# Altium schematic sheet PMP30528_RevB.SchDoc (part 2 of 2)
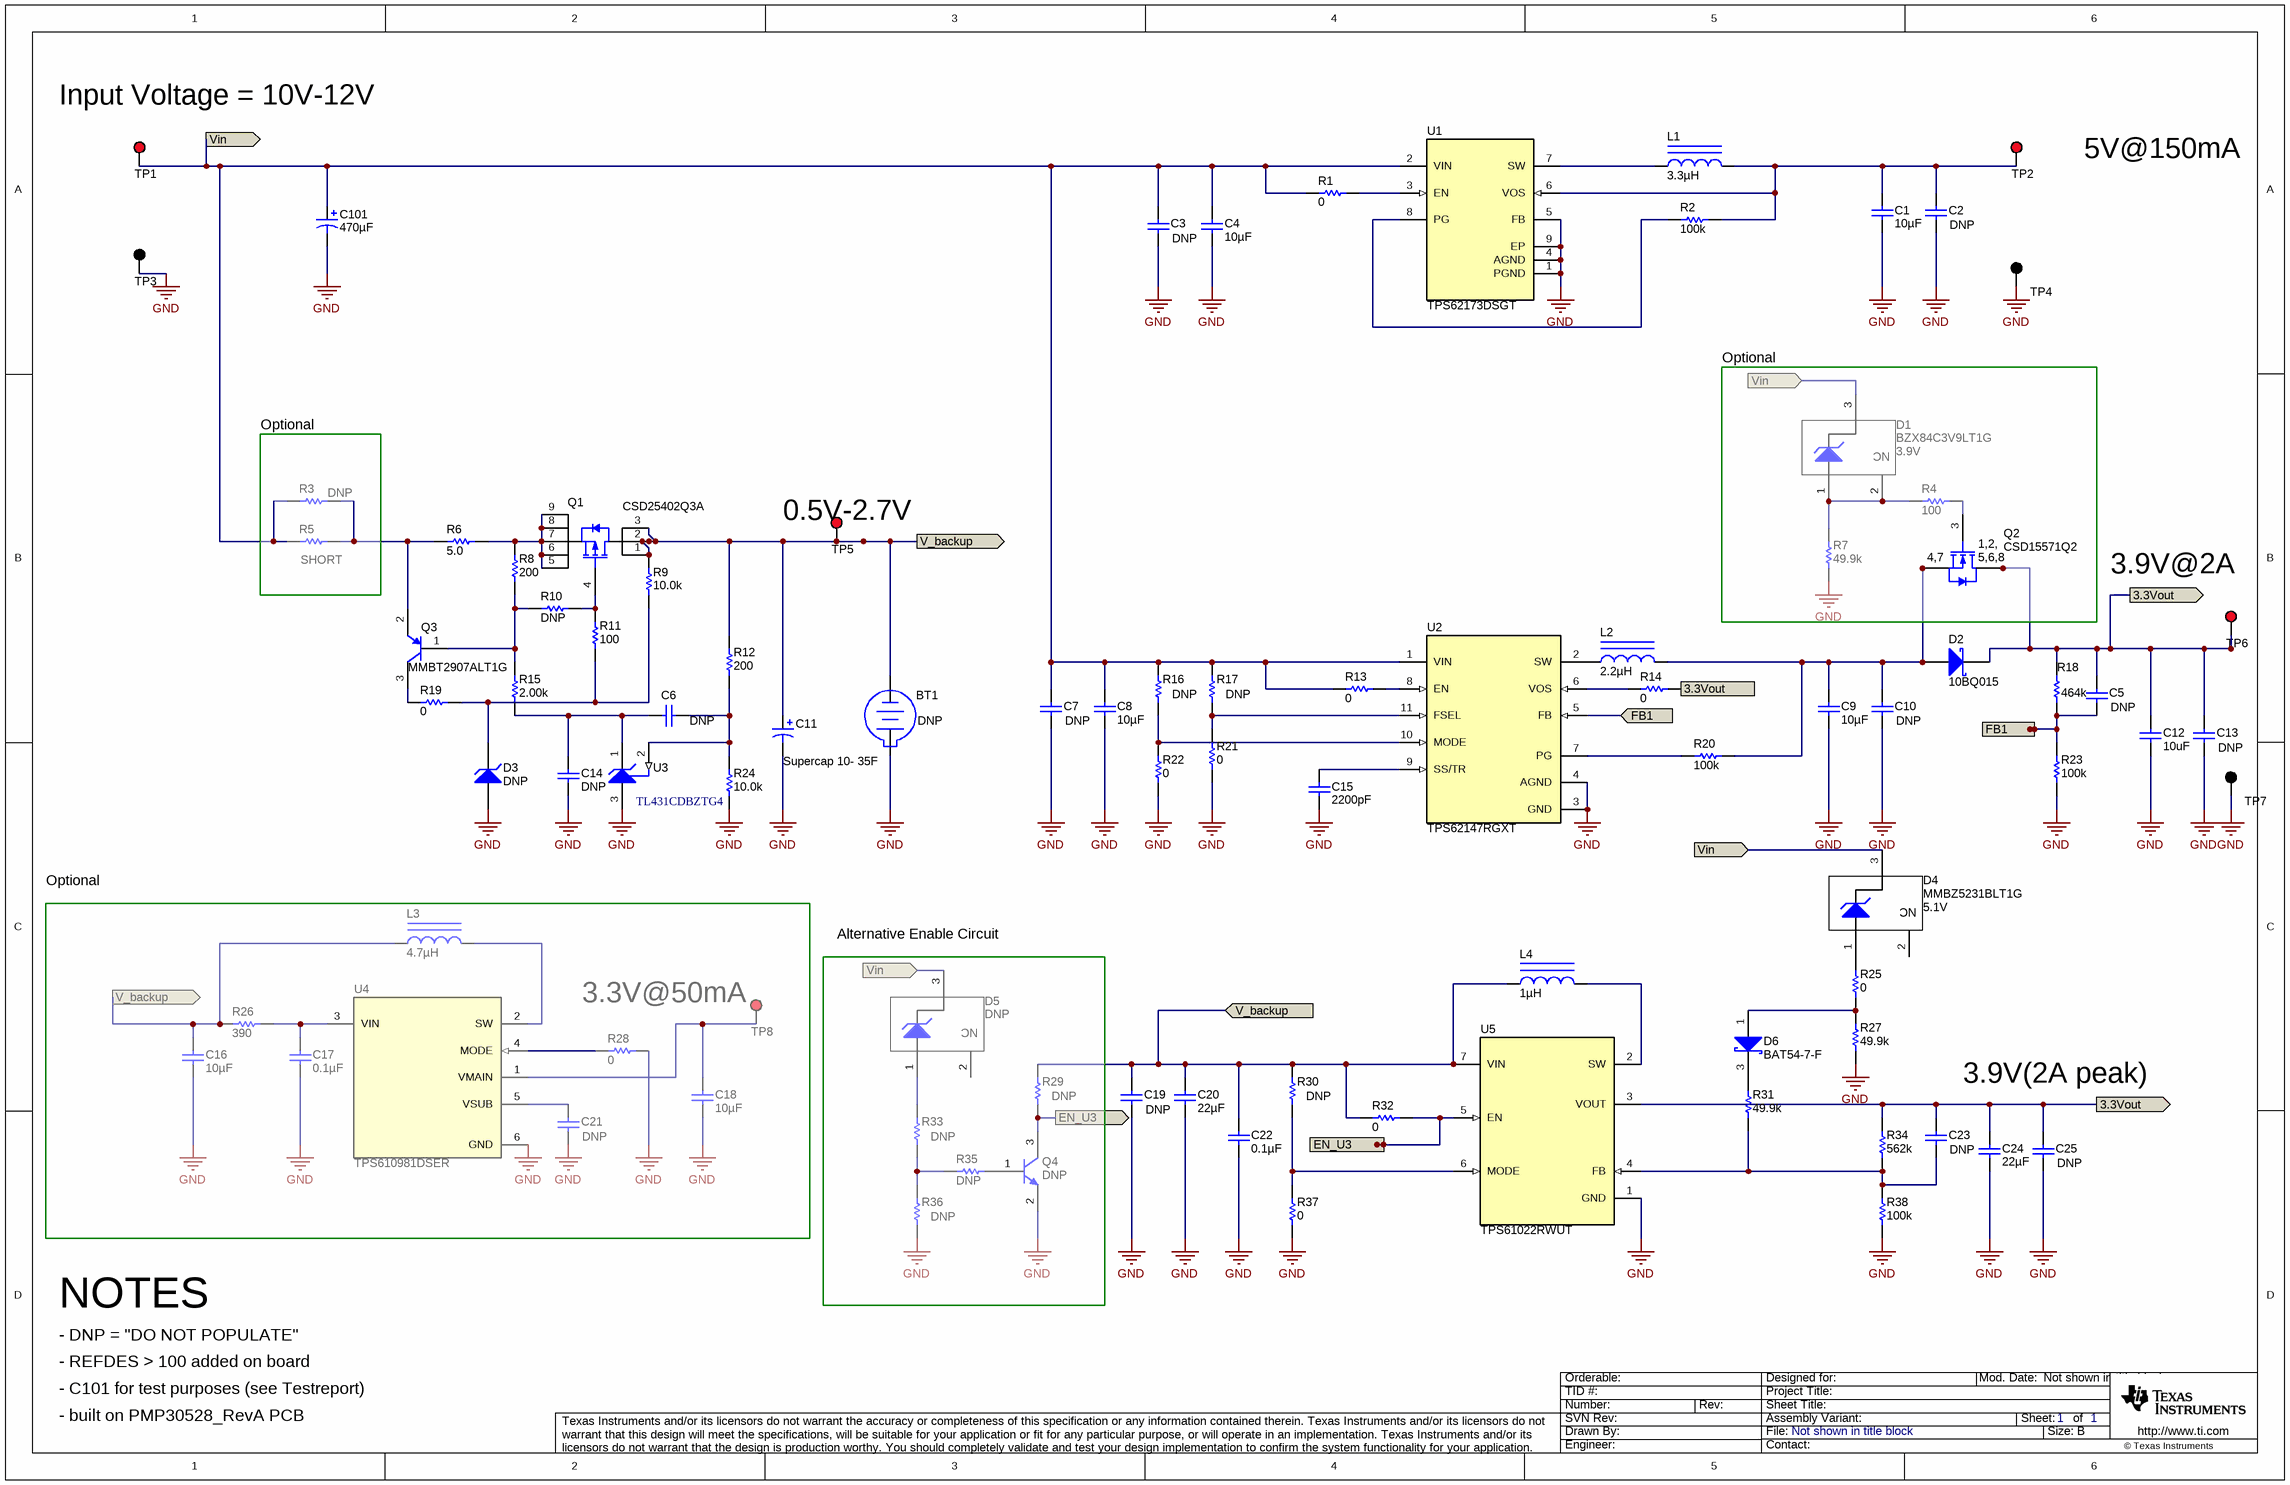
[diagram p1: PMP30528_RevB.SchDoc]

## Library data of the parts
BT1 = CMP-0081781-1: HOLDER CR2032 GOLD LEADS SMD; Manufacturer: Memory Protection Devices; CompType: Battery Holder; ComponentLink1URL: http://www.memoryprotectiondevices.com/datasheets/BU2032SM-BT-GTR-datasheet.pdf; Key: BU2032SM-BT-GTR; Supplier 1: Digi-Key; PackageReference: 31.86x16mm; RoHS: Y; Supplier Part Number 1: BU2032SM-BT-GCT-ND; MountType: SMT; ComponentLink1Description: Datasheet Link
C1 = GRM21BR71A106KE51K: CAP, CERM, 10 µF, 10 V,+/- 10%, X7R, 0805; Manufacturer: MuRata; Polarized: N; CompType: Capacitor; Value: 10uF; U/M: EA; Cap_F: 0.00001; Tolerance_%: 10; Value2: 10V; TaMin_C: -55; TaMax_C: 125; Cap_Case: 0805; SizeArea_mm2: 2.5; SizeAreaWB_mm2: 6.75; SizeX_mm: 2; SizeY_mm: 1.25; SizeZ_mm: 1.45; AEC Category: Q200; Green_Lifecycle: Active; Green_REACh: Passed; SymbolVersion: 2008-07-09; PartNumber: GRM21BR71A106KE51K; PackageReference: 0805; RoHS: Y; VDC_V: 10; MountType: SMT; Technology: Ceramic; TempCo: X7R; Published: 2008-06-19; Publisher: Texas Instruments; LatestRevisionDate: 2017-06-22; ComponentLink1Description: Datasheet link; ComponentLink1URL: http://www.murata.com/~/media/webrenewal/support/library/catalog/products/capacitor/mlcc/c02e.ashx; Supplier 1: Digi-Key; Supplier Part Number 1: 490-6477-1-ND; Supplier 2: Mouser; Supplier Part Number 2: 81-GRM21BR71A106KE1K; AEC Qualified: ?; Green_EU RoHS: Passed; Green_EU RoHS-2: Incomplete
C2 C3 C6 C7 C10 C14 C19 C21 C25 = Capacitor: CAP, CERM, xxxF, xxV, [TempCo], xx%, [PackageReference]; Polarized: N; U/M: EA; CompType: Capacitor; SymbolVersion: 2008-07-09; PackageReference: Used in PnP output and some BOM reports; Manufacturer: Used in BOM report; PartNumber: Used in BOM report; RoHS: Used in BOM report.  Use Y or N.; MountType: SMT or TH (used in PnP report); ComponentLink1Description: Datasheet Link; ComponentLink1URL: Paste URL for datasheet here; Publisher: Texas Instruments; LatestRevisionDate: 2017-05-31; LatestRevisionNote: Added Alternate PartNumber and Alternate Manufacturer parameters to appropriate components.; Alternate Manufacturer: -; Alternate PartNumber: -
C4 = GRM21BZ71E106KE15L: CAP, CERM, 10 µF, 25 V,+/- 10%, X7R, 0805; Manufacturer: MuRata; Polarized: N; CompType: Capacitor; Value: 10uF; U/M: EA; Cap_F: 0.00001; Tolerance_%: 10; VDC_V: 25; Value2: 25V; TaMin_C: -55; TaMax_C: 125; Cap_Case: 0805; SizeArea_mm2: 2.5; SizeAreaWB_mm2: 6.75; SizeX_mm: 2; SizeY_mm: 1.25; SizeZ_mm: 1.45; AEC Category: Q200; SymbolVersion: 2008-07-09; PartNumber: GRM21BZ71E106KE15L; PackageReference: 0805; RoHS: Y; MountType: SMT; Technology: Ceramic; TempCo: X7R; Published: 2008-06-19; Publisher: Texas Instruments; LatestRevisionDate: 2017-06-22; ComponentLink1Description: Datasheet link; ComponentLink1URL: http://search.murata.co.jp/Ceramy/image/img/A01X/G101/ENG/GRM21BZ71E106KE15-01.pdf; Supplier 1: Mouser; Supplier Part Number 1: 81-GRM21BZ71E106KE5L; AEC Qualified: N; AEC Grade: N/A
C5 C23 = Capacitor: CAP, CERM, xxxF, xxV, [TempCo], xx%, [PackageReference]; Manufacturer: Used in BOM report; Polarized: N; U/M: EA; CompType: Capacitor; SymbolVersion: 2008-07-09; Value: DNP; PackageReference: Used in PnP output and some BOM reports; PartNumber: DNP; RoHS: Used in BOM report.  Use Y or N.; MountType: SMT or TH (used in PnP report); ComponentLink1Description: Datasheet Link; ComponentLink1URL: Paste URL for datasheet here; Publisher: Texas Instruments; LatestRevisionDate: 2017-05-31; LatestRevisionNote: Added Alternate PartNumber and Alternate Manufacturer parameters to appropriate components.; Alternate Manufacturer: -; Alternate PartNumber: -
C8 = GRM21BZ71E106KE15L: CAP, CERM, 10 µF, 25 V,+/- 10%, X7R, 0805; Manufacturer: MuRata; Polarized: N; CompType: Capacitor; Value: 10uF; U/M: EA; Cap_F: 0.00001; Tolerance_%: 10; VDC_V: 25; Value2: 25V; TaMin_C: -55; TaMax_C: 125; SizeArea_mm2: 2.5; SizeAreaWB_mm2: 6.75; SizeX_mm: 2; SizeY_mm: 1.25; SizeZ_mm: 1.45; AEC Category: Q200; SymbolVersion: 2008-07-09; PartNumber: GRM21BZ71E106KE15L; PackageReference: 0805; RoHS: Y; MountType: SMT; Technology: Ceramic; TempCo: X7R; Cap_Case: 0805; Published: 2008-06-19; Publisher: Texas Instruments; LatestRevisionDate: 2017-06-22; ComponentLink1Description: Datasheet link; ComponentLink1URL: http://search.murata.co.jp/Ceramy/image/img/A01X/G101/ENG/GRM21BZ71E106KE15-01.pdf; Supplier 1: Mouser; Supplier Part Number 1: 81-GRM21BZ71E106KE5L; AEC Qualified: N; AEC Grade: N/A
C9 = GRM31CR70J106KA01L: CAP, CERM, 10 µF, 6.3 V,+/- 10%, X7R, 1206; Manufacturer: MuRata; Polarized: N; CompType: Capacitor; Value: 10uF; U/M: EA; Cap_F: 0.00001; Tolerance_%: 10; VDC_V: 6.3; Value2: 6.3V; TaMin_C: -55; TaMax_C: 125; Cap_Case: 1206; SizeArea_mm2: 5.12; SizeAreaWB_mm2: 10.92; SizeX_mm: 3.2; SizeY_mm: 1.6; SizeZ_mm: 1.8; AEC Category: Q200; SymbolVersion: 2008-07-09; PartNumber: GRM31CR70J106KA01L; PackageReference: 1206; RoHS: Y; MountType: SMT; Technology: Ceramic; TempCo: X7R; Published: 2008-06-19; Publisher: Texas Instruments; LatestRevisionDate: 2017-06-22; ComponentLink1Description: Datasheet link; ComponentLink1URL: http://search.murata.co.jp/Ceramy/PnsearchViewAction.do?HnOFG=ON&HnNFG=ON&SEL_CNT=50&sLang=en&sKey=GRM31CR70J106KA01L&x=9&y=9&search=startwith; Supplier 1: Digi-Key; Supplier Part Number 1: 490-1806-1-ND; Supplier 2: Mouser; Supplier Part Number 2: 81-GRM426X106K6.3L; Supplier 3: Farnell; Supplier Part Number 3: 9527729; AEC Qualified: ?
C11 = CMP-0084049-1: CAP, Electric Double Layer, 25000000 µF, 2.7 V,+30/-10%, 0.027 ohm, TH; Manufacturer: Eaton; TaMin_C: -40°C; ESR_ohm: 0.027; Polarized: Y; SizeAreaWB_mm2: 324; Value: 25F; TaMax_C: 65°C; Tolerance_%: 30%; SizeZ_mm: 28.4; SizeX_mm: 16; Cap_Case: 16x28.4mm; Value2: 2.7V; SizeArea_mm2: 256; CompType: Capacitor; AEC Qualified: N; AEC Category: Q200; ComponentLink1URL: http://www.cooperindustries.com/content/dam/public/bussmann/Electronics/Resources/product-datasheets/Bus_Elx_DS_4376_HV_Series.pdf; RoHS: Y; Value1: 0.027 ohm; MountType: TH; PackageReference: Dia 16mm; SizeY_mm: 16; Series: HV; Cap_F: 25F; VDC_V: 2.7V; ComponentLink1Description: Datasheet link; AEC Grade: N/A; Technology: Electric Double Layer; ValueDisplayed: 25F
C12 = CMP-0008687-2: CAP, CERM, 10 uF, 6.3 V, +/- 10%, X7R, 1206; Manufacturer: TDK; TaMin_C: -55°C; ESR_ohm: 2.454m; Polarized: N; SizeAreaWB_mm2: 10.92; Value1: 0.002454 ohm; U/M: EA; TaMax_C: 125°C; SizeZ_mm: 1.35; SizeX_mm: 3.2; SizeY_mm: 1.6; Value2: 6.3V; SizeArea_mm2: 5.12; CompType: Capacitor; Cap_F: 10µF; IRMS_A: 4.63182A; AEC Category: Q200; Supplier Part Number 2: 810-C3216X7R1A106K085AC; Publisher: Texas Instruments; Supplier 2: Mouser; TempCo: X7R; Published: 2008-06-19; RoHS: Y; MountType: SMT; Supplier 1: Digi-Key; PackageReference: 1206; Tolerance_%: 10%; Cap_Case: 1206; LatestRevisionDate: 2017-03-09; AEC Qualified: N; VDC_V: 6.3V; ComponentLink1Description: Datasheet link; AEC Grade: N/A; Supplier Part Number 1: 445-14793-1-ND; Technology: Ceramic; ValueDisplayed: 10uF; ComponentLink1URL: https://product.tdk.com/en/search/capacitor/ceramic/mlcc/info?part_no=C3216X7R1A106K085AC
C13 = CMP-0008687-2: CAP, CERM, 1206; Manufacturer: TDK; TaMin_C: -55°C; ESR_ohm: 2.454m; Polarized: N; TempCo: X7R; SizeAreaWB_mm2: 10.92; Value1: 0.002454 ohm; U/M: EA; Value: DNP; TaMax_C: 125°C; Tolerance_%: 10%; SizeZ_mm: 1.35; SizeX_mm: 3.2; SizeY_mm: 1.6; Value2: 10V; SizeArea_mm2: 5.12; CompType: Capacitor; Cap_F: 10µF; IRMS_A: 4.63182A; AEC Category: Q200; Supplier Part Number 2: 810-C3216X7R1A106K085AC; Publisher: Texas Instruments; Supplier 2: Mouser; Published: 2008-06-19; RoHS: Y; MountType: SMT; Supplier 1: Digi-Key; PackageReference: 1206; Cap_Case: 1206; LatestRevisionDate: 2017-03-09; AEC Qualified: N; VDC_V: DNP; ComponentLink1Description: Datasheet link; AEC Grade: N/A; Supplier Part Number 1: 445-14793-1-ND; Technology: Ceramic; ValueDisplayed: DNP; ComponentLink1URL: https://product.tdk.com/en/search/capacitor/ceramic/mlcc/info?part_no=C3216X7R1A106K085AC
C15 = C0603X222K5RACTU: CAP, CERM, 2200 pF, 50 V,+/- 10%, X7R, 0603; Manufacturer: Kemet; Polarized: N; CompType: Capacitor; Value: 2200pF; U/M: EA; Cap_F: 0.0000000022; Tolerance_%: 10; VDC_V: 50; Value2: 50V; TaMin_C: -55; TaMax_C: 125; SizeArea_mm2: 1.28; SizeAreaWB_mm2: 4.68; SizeX_mm: 1.6; SizeY_mm: 0.8; SizeZ_mm: 1; AEC Category: Q200; Green_Lifecycle: Active; Green_REACh: Passed; SymbolVersion: 2008-07-09; PartNumber: C0603X222K5RACTU; PackageReference: 0603; RoHS: Y; MountType: SMT; Technology: Ceramic; TempCo: X7R; Cap_Case: 0603; Published: 2008-06-19; Publisher: Texas Instruments; LatestRevisionDate: 2017-06-22; ComponentLink1Description: Datasheet link; ComponentLink1URL: http://www.kemet.com/kemet/web/homepage/kechome.nsf/vapubfiles/F3102_Y5V.pdf/$file/F3102_Y5V.pdf; Supplier 1: Digi-Key; Supplier Part Number 1: 399-5341-1-ND; Supplier 2: Mouser; Supplier Part Number 2: 80-C0603X222K5R; Supplier 3: Farnell; Supplier Part Number 3: 1414030; AEC Qualified: ?; Green_EU RoHS: Passed; Green_EU RoHS-2: Passed
C16 C18 = GRM21BR70J106KE76L: CAP, CERM, 10 µF, 6.3 V,+/- 10%, X7R, 0805; Manufacturer: MuRata; Polarized: N; CompType: Capacitor; Value: 10uF; U/M: EA; Cap_F: 0.00001; Tolerance_%: 10; VDC_V: 6.3; Value2: 6.3V; TaMin_C: -55; TaMax_C: 125; Cap_Case: 0805; SizeArea_mm2: 2.5; SizeAreaWB_mm2: 6.75; SizeX_mm: 2; SizeY_mm: 1.25; SizeZ_mm: 1.45; AEC Category: Q200; Green_Lifecycle: Active; Green_REACh: Passed; SymbolVersion: 2008-07-09; PartNumber: GRM21BR70J106KE76L; PackageReference: 0805; RoHS: Y; MountType: SMT; Technology: Ceramic; TempCo: X7R; Published: 2008-06-19; Publisher: Texas Instruments; LatestRevisionDate: 2017-06-22; ComponentLink1Description: Datasheet link; ComponentLink1URL: http://search.murata.co.jp/Ceramy/PnsearchViewAction.do?HnOFG=ON&HnNFG=ON&SEL_CNT=50&sLang=en&sKey=GRM21BR70J106KE76L&x=9&y=9&search=startwith; Supplier 1: Digi-Key; Supplier Part Number 1: 490-3904-1-ND; Supplier 2: Mouser; Supplier Part Number 2: 81-GRM21BR70J106KE76; Supplier 3: Farnell; Supplier Part Number 3: 1845768; AEC Qualified: ?; Green_EU RoHS: Passed; Green_EU RoHS-2: Incomplete
C17 = GRM21BR71H104KA01L: CAP, CERM, 0.1 µF, 50 V,+/- 10%, X7R, 0805; Manufacturer: MuRata; Polarized: N; CompType: Capacitor; Value: 0.1uF; U/M: EA; Cap_F: 0.0000001; Tolerance_%: 10; VDC_V: 50; Value2: 50V; TaMin_C: -55; TaMax_C: 125; Cap_Case: 0805; SizeArea_mm2: 2.5; SizeAreaWB_mm2: 6.75; SizeX_mm: 2; SizeY_mm: 1.25; SizeZ_mm: 1.45; AEC Category: Q200; Green_Lifecycle: Active; Green_REACh: Passed; SymbolVersion: 2008-07-09; PartNumber: GRM21BR71H104KA01L; PackageReference: 0805; RoHS: Y; MountType: SMT; Technology: Ceramic; TempCo: X7R; Published: 2008-06-19; Publisher: Texas Instruments; LatestRevisionDate: 2017-06-22; ComponentLink1Description: Datasheet link; ComponentLink1URL: http://search.murata.co.jp/Ceramy/PnsearchViewAction.do?HnOFG=ON&HnNFG=ON&SEL_CNT=50&sLang=en&sKey=GRM21BR71H104KA01L&x=9&y=9&search=startwith; Supplier 1: Digi-Key; Supplier Part Number 1: 490-1666-1-ND; Supplier 2: Mouser; Supplier Part Number 2: 81-GRM40X104K50L; Supplier 3: Farnell; Supplier Part Number 3: 8820120; AEC Qualified: ?; Green_EU RoHS: Passed; Green_EU RoHS-2: Incomplete
C20 = GRM31CR70J226KE19L: CAP, CERM, 22 µF, 6.3 V,+/- 10%, X7R, 1206; Manufacturer: MuRata; Polarized: N; CompType: Capacitor; Value: 22uF; U/M: EA; Cap_F: 0.000022; Tolerance_%: 10; VDC_V: 6.3; Value2: 6.3V; TaMin_C: -55; TaMax_C: 125; Cap_Case: 1206; SizeArea_mm2: 5.12; SizeAreaWB_mm2: 10.92; SizeX_mm: 3.2; SizeY_mm: 1.6; SizeZ_mm: 1.8; AEC Category: Q200; SymbolVersion: 2008-07-09; PartNumber: GRM31CR70J226KE19L; PackageReference: 1206; RoHS: Y; MountType: SMT; Technology: Ceramic; TempCo: X7R; Published: 2008-06-19; Publisher: Texas Instruments; LatestRevisionDate: 2017-06-22; ComponentLink1Description: Datasheet link; ComponentLink1URL: http://search.murata.co.jp/Ceramy/PnsearchViewAction.do?HnOFG=ON&HnNFG=ON&SEL_CNT=50&sLang=en&sKey=GRM31CR70J226KE19L&x=9&y=9&search=startwith; Supplier 1: Digi-Key; Supplier Part Number 1: GRM31CR70J226KE19L-ND; Supplier 2: Mouser; Supplier Part Number 2: 81-GRM31CR70J226KE9L; Supplier 3: Farnell; Supplier Part Number 3: 1845771; AEC Qualified: ?
C22 = GRM188R71H104KA93D: CAP, CERM, 0.1 µF, 50 V,+/- 10%, X7R, 0603; Manufacturer: MuRata; Polarized: N; CompType: Capacitor; Value: 0.1uF; U/M: EA; Cap_F: 0.0000001; Tolerance_%: 10; VDC_V: 50; Value2: 50V; TaMin_C: -55; TaMax_C: 125; SizeArea_mm2: 1.28; SizeAreaWB_mm2: 4.68; SizeX_mm: 1.6; SizeY_mm: 0.8; SizeZ_mm: 1; AEC Category: Q200; Green_Lifecycle: Active; Green_REACh: Passed; SymbolVersion: 2008-07-09; PartNumber: GRM188R71H104KA93D; PackageReference: 0603; RoHS: Y; MountType: SMT; Technology: Ceramic; TempCo: X7R; Cap_Case: 0603; Published: 2008-06-19; Publisher: Texas Instruments; LatestRevisionDate: 2017-06-22; ComponentLink1Description: Datasheet link; ComponentLink1URL: http://search.murata.co.jp/Ceramy/PnsearchViewAction.do?HnOFG=ON&HnNFG=ON&SEL_CNT=50&sLang=en&sKey=GRM188R71H104KA93D&x=9&y=9&search=startwith; Supplier 1: Digi-Key; Supplier Part Number 1: 490-1519-1-ND; Supplier 2: Mouser; Supplier Part Number 2: 81-GRM39X104K50D; Supplier 3: Farnell; Supplier Part Number 3: 8820023; AEC Qualified: ?; Green_EU RoHS: Passed; Green_EU RoHS-2: Incomplete
C24 = GRM31CR71A226ME15L: CAP, CERM, 22 µF, 10 V,+/- 20%, X7R, 1206; Manufacturer: MuRata; Polarized: N; CompType: Capacitor; Value: 22uF; U/M: EA; Cap_F: 0.000022; Tolerance_%: 20; VDC_V: 10; Value2: 10V; TaMin_C: -55; TaMax_C: 125; Cap_Case: 1206; SizeArea_mm2: 5.12; SizeAreaWB_mm2: 10.92; SizeX_mm: 3.2; SizeY_mm: 1.6; SizeZ_mm: 1.8; AEC Category: Q200; Green_Lifecycle: Active; Green_REACh: Passed; SymbolVersion: 2008-07-09; PartNumber: GRM31CR71A226ME15L; PackageReference: 1206; RoHS: Y; MountType: SMT; Technology: Ceramic; TempCo: X7R; Published: 2008-06-19; Publisher: Texas Instruments; LatestRevisionDate: 2017-06-22; ComponentLink1Description: Datasheet link; ComponentLink1URL: http://www.murata.com/~/media/webrenewal/support/library/catalog/products/capacitor/mlcc/c02e.ashx; Supplier 1: Digi-Key; Supplier Part Number 1: 490-6516-1-ND; Supplier 2: Newark; Supplier Part Number 2: 53W0365; Supplier 3: Mouser; Supplier Part Number 3: 81-GRM31CR71A226ME5L; AEC Qualified: ?; Green_EU RoHS: Passed; Green_EU RoHS-2: Incomplete
C101 = EKZE350ELL471MJ20S: CAP, AL, 470 µF, 35 V, +/- 20%, TH; Manufacturer: Chemi-Con; Polarized: Y; CompType: Capacitor; Value: 470uF; U/M: EA; Cap_F: 0.00047; Tolerance_%: 20; VDC_V: 35; Value2: 35V; IRMS_A: 1.82; TaMin_C: -40; TaMax_C: 105; Cap_Case: 10x20; SizeAreaWB_mm2: 144; SizeArea_mm2: 100; SizeX_mm: 10; SizeZ_mm: 21.5; AEC Category: Q200; AEC Qualified: N; SymbolVersion: 2008-07-09; PartNumber: EKZE350ELL471MJ20S; PackageReference: D10xL20mm; RoHS: Y; MountType: TH; Technology: AL; Series: KZE; SizeY_mm: 10; Publisher: Texas Instruments; LatestRevisionDate: 2017-06-22; ComponentLink1Description: Datasheet link; ComponentLink1URL: http://www.chemi-con.co.jp/cgi-bin/CAT_DB/SEARCH/cat_db_al.cgi?e=e&j=p&pdfname=kze; Supplier 1: Digi-Key; Supplier Part Number 1: 565-1694-ND; Supplier 2: Mouser; Supplier Part Number 2: 661-EKZE350ELL471MJ20S; AEC Grade: N/A
D1 = BZX84C3V9LT1G: Diode, Zener, 3.9 V, 225 mW, SOT-23; Manufacturer: ON Semiconductor; U/M: EA; Power_W: 0.225; Vz_V: 3.9; Value1: 0.225W; RJA_CperW: 556; SizeAreaWB_mm2: 14; SizeArea_mm2: 7.5; SizeX_mm: 2.5; SizeY_mm: 3; SizeZ_mm: 1.1; AEC Category: Q101; CompType: Zener; SymbolVersion: 2010-08-25; PartNumber: BZX84C3V9LT1G; MountType: SMT; RoHS: Y; PackageReference: SOT-23; Vr_V: N/A; ComponentLink1Description: Datasheet link; ComponentLink1URL: http://www.onsemi.com/pub_link/Collateral/BZX84C2V4LT1-D.PDF; Published: 2008-10-08; Publisher: Texas Instruments; LatestRevisionDate: 2017-06-20; LatestRevisionNote: Updated Supplier Data; Supplier 1: Digi-Key; Supplier Part Number 1: BZX84C3V9LT1GOSCT-ND; Supplier 2: Newark; Supplier Part Number 2: 98H0523; Supplier 3: Mouser; Supplier Part Number 3: 863-BZX84C3V9LT1G; AEC Qualified: ?
D2 = VS-10BQ030HM3/5BT: Diode, Schottky, 15 V, 1 A, SMB; Manufacturer: Vishay-Semiconductor; U/M: EA; Vf_V: 0.42; Value: 15V; Value1: 1A; Value2: 0.42V; Io_A: 1; Vr_V: 30; TJmax_C: 150; SizeAreaWB_mm2: 44.156; SizeArea_mm2: 21.336; SizeX_mm: 5.6; SizeY_mm: 3.81; SizeZ_mm: 2.6; AEC Category: Q101; AEC Qualified: Y; Green_Lifecycle: Not Set; Green_REACh: Incomplete; CompType: Diode; SymbolVersion: 2008-12-08; PartNumber: 10BQ015; PackageReference: SMB; MountType: SMT; Type: Schottky; RoHS: Y; Published: 2008-06-26; Publisher: Texas Instruments; LatestRevisionDate: 2017-06-19; ComponentLink1Description: Datasheet link; ComponentLink1URL: http://www.vishay.com/docs/95740/vs-10bq030hm3.pdf; Supplier 1: Digi-Key; Supplier Part Number 1: VS-10BQ030HM3/5BT-ND; Supplier 2: Mouser; Supplier Part Number 2: 78-VS-10BQ030HM3/5BT; Green_EU RoHS: Incomplete; Green_EU RoHS-2: Incomplete
D3 = BZT52C2V7T-7: Diode, Zener; Manufacturer: Diodes Inc.; SymbolCreator: a0412235; U/M: EA; Power_W: 0.3; Vz_V: 2.7; Value1: 0.3W; RJA_CperW: 417; SizeAreaWB_mm2: 5.13; SizeArea_mm2: 1.53; SizeX_mm: 1.7; SizeY_mm: 0.9; SizeZ_mm: 0.65; AEC Category: Q101; SymbolVersion: 2010-08-25; Value: DNP; PartNumber: DNP; PackageReference: SOD-523; CompType: Zener; Vr_V: N/A; MountType: SMT; RoHS: Y; ComponentLink1Description: Datasheet link; ComponentLink1URL: http://www.diodes.com/datasheets/ds30502.pdf; Published: 2008-10-08; Publisher: Texas Instruments; LatestRevisionDate: 2017-06-20; LatestRevisionNote: Updated Supplier Data; Supplier 1: Digi-Key; Supplier Part Number 1: BZT52C2V7T-7DICT-ND; Supplier 2: Newark; Supplier Part Number 2: 51R6414; Supplier 3: Mouser; Supplier Part Number 3: 621-BZT52C2V7T-7; AEC Qualified: ?
D4 = MMBZ5231BLT1G: Diode, Zener, 5.1 V, 225 mW, SOT-23; Manufacturer: ON Semiconductor; U/M: EA; Power_W: 0.225; Vz_V: 5.1; Value1: 0.225W; RJA_CperW: 556; SizeAreaWB_mm2: 14; SizeArea_mm2: 7.5; SizeX_mm: 2.5; SizeY_mm: 3; SizeZ_mm: 1.1; AEC Category: Q101; Green_Lifecycle: Active; Green_REACh: Passed; CompType: Zener; SymbolVersion: 2010-08-25; PartNumber: MMBZ5231BLT1G; MountType: SMT; RoHS: Y; PackageReference: SOT-23; Vr_V: N/A; ComponentLink1Description: Datasheet link; ComponentLink1URL: http://www.onsemi.com/pub_link/Collateral/MMBZ5221BLT1-D.PDF; Published: 2008-10-08; Publisher: Texas Instruments; LatestRevisionDate: 2017-06-20; LatestRevisionNote: Updated Supplier Data; Supplier 1: Digi-Key; Supplier Part Number 1: MMBZ5231BLT1GOSCT-ND; Supplier 2: Newark; Supplier Part Number 2: 88H4809; Supplier 3: Mouser; Supplier Part Number 3: 863-MMBZ5231BLT1G; AEC Qualified: ?; Green_EU RoHS: Passed; Green_EU RoHS-2: Passed
D5 = MMBZ5231BLT1G: Diode, Zener; Manufacturer: ON Semiconductor; U/M: EA; Power_W: 0.225; Vz_V: 5.1; Value1: 0.225W; RJA_CperW: 556; SizeAreaWB_mm2: 14; SizeArea_mm2: 7.5; SizeX_mm: 2.5; SizeY_mm: 3; SizeZ_mm: 1.1; AEC Category: Q101; Green_Lifecycle: Active; Green_REACh: Passed; CompType: Zener; SymbolVersion: 2010-08-25; PartNumber: DNP; MountType: SMT; RoHS: Y; Value: DNP; PackageReference: SOT-23; Vr_V: N/A; ComponentLink1Description: Datasheet link; ComponentLink1URL: http://www.onsemi.com/pub_link/Collateral/MMBZ5221BLT1-D.PDF; Published: 2008-10-08; Publisher: Texas Instruments; LatestRevisionDate: 2017-06-20; LatestRevisionNote: Updated Supplier Data; Supplier 1: Digi-Key; Supplier Part Number 1: MMBZ5231BLT1GOSCT-ND; Supplier 2: Newark; Supplier Part Number 2: 88H4809; Supplier 3: Mouser; Supplier Part Number 3: 863-MMBZ5231BLT1G; AEC Qualified: ?; Green_EU RoHS: Passed; Green_EU RoHS-2: Passed
D6 = BAT54-7-F: Diode, Schottky, 30 V, 0.2 A, SOT-23; Manufacturer: Diodes Inc.; U/M: EA; Vf_V: 0.65; Value: 30V; Value1: 0.2A; Value2: 0.65V; Io_A: 0.2; Vr_V: 30; TJmax_C: 125; SizeAreaWB_mm2: 14; SizeArea_mm2: 7.5; SizeX_mm: 2.5; SizeY_mm: 3; SizeZ_mm: 1.1; AEC Category: Q101; Green_Lifecycle: Active; Green_REACh: Passed; SymbolVersion: 2008-07-09; PartNumber: BAT54-7-F; PackageReference: SOT-23; CompType: Diode; MountType: SMT; Type: Schottky; RoHS: Y; Published: 2008-06-26; Publisher: Texas Instruments; LatestRevisionDate: 2017-06-19; ComponentLink1Description: Datasheet link; ComponentLink1URL: http://www.diodes.com/datasheets/ds11005.pdf; Supplier 1: Digi-Key; Supplier Part Number 1: BAT54-FDICT-ND; Supplier 2: Mouser; Supplier Part Number 2: 621-BAT54-F; AEC Qualified: ?; Green_EU RoHS: Passed; Green_EU RoHS-2: Passed
L1 = LPS3015-332MLB: Inductor, Shielded Drum Core, Ferrite, 3.3 µH, 1.4 A, 0.13 ohm, SMD; Manufacturer: Coilcraft; Value: 3.3uH; Ind_H: 3.3E-6; Imax_A: 1.4; Irms: 1.4A @ 40C rise; Isat: 1.5A @ 30% inductance drop; DCR_ohm: 0.13; Value2: 1.4A; SizeAreaWB_mm2: 15.6025; SizeArea_mm2: 8.7025; SizeX_mm: 2.95; AEC Category: Q200; Green_Lifecycle: Not Set; Green_REACh: Incomplete; SymbolVersion: 2008-07-23; CompType: Inductor; PartNumber: LPS3015-332MLB; Value1: 0.13 ohm; Technology: Shielded Drum Core; MountType: SMT; Material: Ferrite; PackageReference: LPS3015; Published: 2008-06-26; Publisher: Texas Instruments; LatestRevisionDate: 2017-05-12; ComponentLink1Description: Datasheet link; ComponentLink1URL: http://www.coilcraft.com/pdfs/lps3015.pdf; RoHS: Y; SizeY_mm: 2.95; SizeZ_mm: 1.4; AEC Qualified: ?; Green_EU RoHS: Incomplete; Green_EU RoHS-2: Incomplete
L2 = XFL4020-222MEB: Inductor, Shielded, Composite, 2.2 µH, 3.7 A, 0.02 ohm, SMD; Manufacturer: Coilcraft; Value: 2.2uH; Ind_H: 2.2E-6; Imax_A: 3.7; Irms: 8A @ 40C rise; Isat: 3.7A @ 30% inductance drop; DCR_ohm: 0.02; Value2: 3.7A; SizeAreaWB_mm2: 25; SizeArea_mm2: 16; SizeX_mm: 4; SizeZ_mm: 2.15; AEC Category: Q200; Green_Lifecycle: Not Set; Green_REACh: Incomplete; SymbolVersion: 2008-07-23; CompType: Inductor; PartNumber: XFL4020-222MEB; Value1: 0.02 ohm; Technology: Shielded; MountType: SMT; Material: Composite; PackageReference: 4x2x4mm; Published: 2008-06-26; Publisher: Texas Instruments; LatestRevisionDate: 2017-05-12; ComponentLink1Description: Datasheet link; ComponentLink1URL: http://www.coilcraft.com/pdfs/xfl4020.pdf; RoHS: Y; SizeY_mm: 4; Supplier 1: Mouser; Supplier Part Number 1: 994-XFL4020-222MEB; AEC Qualified: ?; Green_EU RoHS: Incomplete; Green_EU RoHS-2: Incomplete
L3 = VLF302510MT-4R7M: Inductor, Shielded, Ferrite, 4.7 µH, 0.86 A, 0.168 ohm, SMD; Manufacturer: TDK; Value: 4.7uH; Ind_H: 4.7E-6; Imax_A: 0.86; Irms: 1.08A @ 40C rise; Isat: 0.86A @ 30% inductance drop; DCR_ohm: 0.168; Value2: 0.86A; SizeAreaWB_mm2: 15.54; SizeArea_mm2: 8.64; SizeX_mm: 2.7; SizeY_mm: 3.2; SizeZ_mm: 1; AEC Category: Q200; Green_Lifecycle: Active; Green_REACh: Passed; SymbolVersion: 2008-07-23; CompType: Inductor; PartNumber: VLF302510MT-4R7M; Value1: 0.168 ohm; Technology: Shielded; MountType: SMT; Material: Ferrite; PackageReference: IND_3x1x2.5mm; Published: 2008-06-26; Publisher: Texas Instruments; LatestRevisionDate: 2017-06-22; ComponentLink1Description: Datasheet link; ComponentLink1URL: http://product.tdk.com/inductor/ind/en/documents/inductor_commercial_power_vlf_en.pdf; RoHS: Y; Supplier 1: Digi-Key; Supplier Part Number 1: 445-6773-1-ND; AEC Qualified: ?; Green_EU RoHS: Passed; Green_EU RoHS-2: Incomplete
L4 = XAL6030-102MEB: Inductor, Shielded, Composite, 1 µH, 21.5 A, 0.01 ohm, SMD; Manufacturer: Coilcraft; Value: 1uH; Ind_H: 1.0E-6; Imax_A: 21.5; Irms: 21.5A @ 40C rise; Isat: 23A @ 30% inductance drop; DCR_ohm: 0.01; Value2: 21.5A; SizeAreaWB_mm2: 71.5616; SizeArea_mm2: 41.7216; SizeX_mm: 6.36; SizeY_mm: 6.56; SizeZ_mm: 3.1; AEC Category: Q200; Green_Lifecycle: Not Set; Green_REACh: Incomplete; SymbolVersion: 2008-07-23; CompType: Inductor; PartNumber: XAL6030-102MEB; Value1: 0.01 ohm; Technology: Shielded; MountType: SMT; Material: Composite; PackageReference: IND_6.4x3.1x6.6; Published: 2008-06-26; Publisher: Texas Instruments; LatestRevisionDate: 2017-05-12; ComponentLink1Description: Datasheet link; ComponentLink1URL: http://www.coilcraft.com/pdf_viewer/showpdf.cfm?f=pdf_store:xal60xx.pdf; RoHS: Y; AEC Qualified: ?; Green_EU RoHS: Incomplete; Green_EU RoHS-2: Incomplete
Q1 = CSD25402Q3A: MOSFET, P-CH, -20 V, -15 A, DNH0008A (VSONP-8); Manufacturer: Texas Instruments; Alternate Manufacturer: None; SymbolCreator: a0799628; U/M: EA; ChType: P; Value: -20V; Value1: 0.0077 ohm; Rdson45_ohm: 0.0077; Value2: 7.5 nC; QgTyp_nC: 7.5; Vgs_V: -12; SizeAreaWB_mm2: 18.49; SizeArea_mm2: 10.89; SizeX_mm: 3.3; SizeZ_mm: 0.9; AEC Category: Q101; SymbolVersion: 2014-08-22; PartNumber: CSD25402Q3A; PackageReference: DNH0008A; CompType: MOSFET; VdsMax_V: -20; IdsMax_A: -15; SizeY_mm: 3.3; RoHS: Y; MountType: SMT; Published: 2008-06-19; Publisher: Texas Instruments; LatestRevisionDate: 2017-06-23; LatestRevisionNote: Added parts.; ComponentLink1Description: Datasheet link; ComponentLink1URL: http://www.ti.com/lit/ds/symlink/csd25402q3a.pdf; Supplier 1: Digi-Key; Supplier Part Number 1: CSD25402Q3A-ND; Supplier 2: Newark; Supplier Part Number 2: 29X0650; Supplier 3: Mouser; Supplier Part Number 3: 595-CSD25402Q3A; AEC Qualified: ?
Q2 = CMP-0000207-1: MOSFET, N-CH, 20 V, 10 A, DQK0006C (WSON-6); Alternate Manufacturer: None; Manufacturer: Texas Instruments; SizeZ_mm: 0.8; ChType: N; Value2: 2.5 nC; Value1: 19; VdsMax_V: 20V; SizeX_mm: 2; Value: 20V; Rdson45_ohm: 19.2; SizeArea_mm2: 4; AEC Category: Q101; IdsMax_A: 10A; SizeAreaWB_mm2: 9; U/M: EA; QgTyp_nC: 2.5; Supplier 2: Newark; Supplier 3: Mouser; Supplier 1: Digi-Key; Supplier Part Number 1: CSD15571Q2-ND; Supplier Part Number 2: 06X5215; PartNumber: CSD15571Q2; ComponentLink1Description: Datasheet link; LatestRevisionDate: 2017-03-09; ComponentLink1URL: http://www.ti.com/lit/ds/symlink/csd15571q2.pdf; SizeY_mm: 2; Vgs_V: 20V; CompType: MOSFET; PackageReference: DQK0006C; LatestRevisionNote: Added parts.; Publisher: Texas Instruments; AEC Qualified: N; Published: 2008-06-19; Supplier Part Number 3: 595-CSD15571Q2; RoHS: Y; MountType: SMT
Q3 = MMBT2907ALT1G, ON Semiconductor: Transistor, PNP, 60 V, 0.6 A, SOT-23; CompType: BJT; PNP: 1; NPN: 0; Vceo_V: 60; Vcesat1_V: 1.6; Value: 60 V; IcRated_A: 0.6; Value1: 0.6 A; TaMin_C: -55; TaMax_C: 150; SizeAreaWB_mm2: 14; SizeArea_mm2: 7.5; SizeX_mm: 2.5; SizeY_mm: 3; SizeZ_mm: 1.1; U/M: EA; AEC Category: Q101; Green_Lifecycle: Active; Green_REACh: Passed; SymbolVersion: 2008-07-31; PartNumber: MMBT2907ALT1G; Manufacturer: ON Semiconductor; PackageReference: SOT-23; RoHS: Y; Published: 2008-07-31; LatestRevisionDate: 2017-06-09; Publisher: Texas Instruments; ComponentLink1Description: Datasheet link; ComponentLink1URL: http://www.onsemi.com/pub_link/Collateral/MMBT2907ALT1-D.PDF; Supplier 1: Digi-Key; Supplier Part Number 1: MMBT2907ALT1GOSCT-ND; Supplier 2: Newark; Supplier Part Number 2: 88H4785; Supplier 3: Mouser; Supplier Part Number 3: 863-MMBT2907ALT1G; MountType: SMT; AEC Qualified: ?; Green_EU RoHS: Passed; Green_EU RoHS-2: Passed
Q4 = MMBT3904, Fairchild Semiconductor: Transistor, NPN, 40 V, 0.2 A, SOT-23; CompType: BJT; PNP: 0; NPN: 1; Vceo_V: 40; Vcesat1_V: 0.2; Value1: 0.2 A; HfeMax: 300; TaMin_C: -55; TaMax_C: 150; SizeAreaWB_mm2: 14; SizeArea_mm2: 7.5; SizeX_mm: 2.5; SizeY_mm: 3; SizeZ_mm: 1.1; U/M: EA; AEC Category: Q101; Green_Lifecycle: Active; Green_REACh: Passed; SymbolVersion: 2008-07-31; PartNumber: DNP; Manufacturer: Fairchild Semiconductor; PackageReference: SOT-23; RoHS: Y; Value: DNP; IcRated_A: 0.2; Value2: 300; Published: 2008-07-31; LatestRevisionDate: 2017-06-09; Publisher: Texas Instruments; ComponentLink1Description: Datasheet link; ComponentLink1URL: http://www.fairchildsemi.com/ds/MM/MMBT3904.pdf; Supplier 1: Digi-Key; Supplier Part Number 1: MMBT3904FSCT-ND; Supplier 2: Newark; Supplier Part Number 2: 58K9431; Supplier 3: Farnell; Supplier Part Number 3: 9846727; MountType: SMT; AEC Qualified: ?; Green_EU RoHS: Passed; Green_EU RoHS-2: Passed
R1 R13 R14 R19 R25 R28 R32 R37 = CRCW06030000Z0EA: RES, 0, 5%, 0.1 W, 0603; Manufacturer: Vishay-Dale; CompType: Resistor; Value: 0; Value_Code: 0000; Tolerance_%: 5; Power_W: 0.1; Value2: 0.1W; VDC_V: 75; TempCo: 200 ppm/C; SizeArea_mm2: 1.28; SizeX_mm: 1.6; SizeY_mm: 0.8; SizeZ_mm: 1; EIA_Code: E24; U/M: EA; AEC Category: Q200; Green_Lifecycle: Active; Green_REACh: Passed; SymbolVersion: 2009-05-29; PartNumber: CRCW06030000Z0EA; PackageReference: 0603; RoHS: Y; Res_ohm: 0; Value1: 5%; MountType: SMT; Technology: Thick Film; Published: 2008-06-26; Publisher: Texas Instruments; LatestRevisionDate: 2017-06-13; ComponentLink1Description: Datasheet link; ComponentLink1URL: http://www.vishay.com/docs/20035/dcrcwe3.pdf; Supplier 1: Digi-Key; Supplier Part Number 1: 541-0.0GCT-ND; Supplier 2: Newark; Supplier Part Number 2: 52K8014; Supplier 3: Mouser; Supplier Part Number 3: 71-CRCW0603-0-E3; AEC Qualified: ?; Green_EU RoHS: Passed with Exemption; Green_EU RoHS-2: Passed
R2 R20 R23 R38 = CRCW0603100KFKEA: RES, 100 k, 1%, 0.1 W, 0603; Manufacturer: Vishay-Dale; CompType: Resistor; Value: 100k; Res_ohm: 100000; Tolerance_%: 1; Power_W: 0.1; Value2: 0.1W; VDC_V: 75; TempCo: 100 ppm/C; SizeArea_mm2: 1.28; SizeX_mm: 1.6; SizeY_mm: 0.8; EIA_Code: E96; U/M: EA; AEC Category: Q200; Green_Lifecycle: Active; Green_REACh: Passed; SymbolVersion: 2009-05-29; PartNumber: CRCW0603100KFKEA; PackageReference: 0603; RoHS: Y; Value_Code: 100k; Value1: 1%; MountType: SMT; Technology: Thick Film; SizeZ_mm: 1; Published: 2008-06-26; Publisher: Texas Instruments; LatestRevisionDate: 2017-06-13; ComponentLink1Description: Datasheet link; ComponentLink1URL: http://www.vishay.com/docs/20035/dcrcwe3.pdf; Supplier 1: Digi-Key; Supplier Part Number 1: 541-100KHCT-ND; Supplier 2: Newark; Supplier Part Number 2: 42K3668; Supplier 3: Mouser; Supplier Part Number 3: 71-CRCW0603-100K-E3; AEC Qualified: ?; Green_EU RoHS: Passed with Exemption; Green_EU RoHS-2: Passed
R3 = PNP300JR-73-47R: RES, 47, 5%, 3 W, 3W Axial resistor; Manufacturer: Yageo America; Res_ohm: 47; Value_Code: 47R0; Tolerance_%: 5; Power_W: 3; TempCo: 300 ppm/C; EIA_Code: E24; U/M: EA; AEC Category: Q200; CompType: Resistor; SymbolVersion: 2009-05-29; PartNumber: PNP300JR-73-47R; ValueDisplayed: DNP; PackageReference: 3W Axial resistor; RoHS: Y; Value1: 5%; Value2: 3W; MountType: TH; Technology: Metal Element; Published: 2013-01-08; Publisher: Texas Instruments; LatestRevisionDate: 2017-05-10; ComponentLink1Description: Datasheet link; ComponentLink1URL: http://www.yageo.com/documents/recent/High%20Power%20Type_PNP.pdf; Supplier 1: Digi-Key; Supplier Part Number 1: 47AECT-ND; AEC Qualified: ?
R4 R11 = CRCW0805100RFKEA: RES, 100, 1%, 0.125 W, 0805; Manufacturer: Vishay-Dale; CompType: Resistor; Value: 100; Value_Code: 100R; Tolerance_%: 1; Power_W: 0.125; Value2: 0.125W; VDC_V: 150; TempCo: 100 ppm/C; SizeArea_mm2: 2.5; SizeX_mm: 2; SizeY_mm: 1.25; SizeZ_mm: 1.45; EIA_Code: E96; U/M: EA; AEC Category: Q200; Green_Lifecycle: Active; Green_REACh: Passed; SymbolVersion: 2009-05-29; PartNumber: CRCW0805100RFKEA; PackageReference: 0805; RoHS: Y; Res_ohm: 100; Value1: 1%; MountType: SMT; Technology: Thick Film; Published: 2008-06-26; Publisher: Texas Instruments; LatestRevisionDate: 2017-06-23; ComponentLink1Description: Datasheet link; ComponentLink1URL: http://www.vishay.com/docs/20035/dcrcwe3.pdf; Supplier 1: Digi-Key; Supplier Part Number 1: 541-100CCT-ND; Supplier 2: Newark; Supplier Part Number 2: 52K9809; Supplier 3: Mouser; Supplier Part Number 3: 71-CRCW0805-100-E3; AEC Qualified: ?; Green_EU RoHS: Passed with Exemption; Green_EU RoHS-2: Passed
R5 = PNP300JR-73-47R: RES, 3 W, 3W Axial resistor; Manufacturer: Yageo America; Res_ohm: 47; Value_Code: 47R0; Tolerance_%: 5; Value1: 5%; Power_W: 3; TempCo: 300 ppm/C; EIA_Code: E24; U/M: EA; AEC Category: Q200; CompType: Resistor; SymbolVersion: 2009-05-29; Value: SHORT; PartNumber: SHORT; ValueDisplayed: SHORT; PackageReference: 3W Axial resistor; RoHS: Y; Value2: 3W; MountType: TH; Technology: Metal Element; Published: 2013-01-08; Publisher: Texas Instruments; LatestRevisionDate: 2017-05-10; ComponentLink1Description: Datasheet link; ComponentLink1URL: http://www.yageo.com/documents/recent/High%20Power%20Type_PNP.pdf; Supplier 1: Digi-Key; Supplier Part Number 1: 47AECT-ND; AEC Qualified: ?
R6 = CMP-0018058-2: RES, 5.0ohm, 1%, 0.25 W, 1206; Manufacturer: Yageo America; PartNumber: RC1206FR-071R96L; Power_W: 250mW; TempCo: 200 ppm/C; Value_Code: 1R96; U/M: EA; Value: 1.96; EIA_Code: E96; SizeX_mm: 3.2; SizeY_mm: 1.6; SizeZ_mm: 1.35; Value2: 0.25W; SizeArea_mm2: 5.12; VDC_V: 200V; AEC Category: Q200; Supplier Part Number 2: 4396315; Publisher: Texas Instruments; Supplier 2: Farnell; Published: 2008-06-26; RoHS: Y; Value1: 1%; MountType: SMT; Supplier 1: Digi-Key; PackageReference: 1206; Tolerance_%: 1%; Res_ohm: 1.96; CompType: Resistor; LatestRevisionDate: 2017-03-09; AEC Qualified: ?; ComponentLink1Description: Datasheet link; Supplier Part Number 1: 311-1.96FRCT-ND; Technology: Thick Film; ComponentLink1URL: http://www.yageo.com/pdf/Pu-RC1206_51_PbFree_L_2.pdf
R7 R27 R31 = CRCW080549K9FKEA: RES, 49.9 k, 1%, 0.125 W, 0805; Manufacturer: Vishay-Dale; CompType: Resistor; Value: 49.9k; Res_ohm: 49900; Value_Code: 49k9; Tolerance_%: 1; Power_W: 0.125; Value2: 0.125W; VDC_V: 150; TempCo: 100 ppm/C; SizeArea_mm2: 2.5; SizeX_mm: 2; SizeY_mm: 1.25; SizeZ_mm: 1.45; EIA_Code: E96; U/M: EA; AEC Category: Q200; Green_Lifecycle: Active; Green_REACh: Passed; SymbolVersion: 2009-05-29; PartNumber: CRCW080549K9FKEA; PackageReference: 0805; RoHS: Y; Value1: 1%; MountType: SMT; Technology: Thick Film; Published: 2008-06-26; Publisher: Texas Instruments; LatestRevisionDate: 2017-06-23; ComponentLink1Description: Datasheet link; ComponentLink1URL: http://www.vishay.com/docs/20035/dcrcwe3.pdf; Supplier 1: Digi-Key; Supplier Part Number 1: 541-49.9KCCT-ND; Supplier 2: Newark; Supplier Part Number 2: 53K0291; Supplier 3: Mouser; Supplier Part Number 3: 71-CRCW0805-49.9K-E3; AEC Qualified: ?; Green_EU RoHS: Passed with Exemption; Green_EU RoHS-2: Passed
R8 R12 = CRCW0603200RFKEA: RES, 200, 1%, 0.1 W, 0603; Manufacturer: Vishay-Dale; CompType: Resistor; Value: 200; Value_Code: 200R; Tolerance_%: 1; Power_W: 0.1; Value2: 0.1W; VDC_V: 75; TempCo: 100 ppm/C; SizeArea_mm2: 1.28; SizeX_mm: 1.6; SizeY_mm: 0.8; EIA_Code: E96; U/M: EA; AEC Category: Q200; Green_Lifecycle: Active; Green_REACh: Passed; SymbolVersion: 2009-05-29; PartNumber: CRCW0603200RFKEA; PackageReference: 0603; RoHS: Y; Res_ohm: 200; Value1: 1%; MountType: SMT; Technology: Thick Film; SizeZ_mm: 1; Published: 2008-06-26; Publisher: Texas Instruments; LatestRevisionDate: 2017-06-13; ComponentLink1Description: Datasheet link; ComponentLink1URL: http://www.vishay.com/docs/20035/dcrcwe3.pdf; Supplier 1: Digi-Key; Supplier Part Number 1: 541-200HCT-ND; Supplier 2: Newark; Supplier Part Number 2: 52K8273; Supplier 3: Mouser; Supplier Part Number 3: 71-CRCW0603-200-E3; AEC Qualified: ?; Green_EU RoHS: Passed with Exemption; Green_EU RoHS-2: Passed
R9 R24 = CRCW060310K0FKEA: RES, 10.0 k, 1%, 0.1 W, 0603; Manufacturer: Vishay-Dale; CompType: Resistor; Value: 10.0k; Res_ohm: 10000; Value_Code: 10k0; Tolerance_%: 1; Power_W: 0.1; Value2: 0.1W; VDC_V: 75; TempCo: 100 ppm/C; SizeArea_mm2: 1.28; SizeX_mm: 1.6; SizeY_mm: 0.8; EIA_Code: E96; U/M: EA; AEC Category: Q200; Green_Lifecycle: Active; Green_REACh: Passed; SymbolVersion: 2009-05-29; PartNumber: CRCW060310K0FKEA; PackageReference: 0603; RoHS: Y; Value1: 1%; MountType: SMT; Technology: Thick Film; SizeZ_mm: 1; Published: 2008-06-26; Publisher: Texas Instruments; LatestRevisionDate: 2017-06-13; ComponentLink1Description: Datasheet link; ComponentLink1URL: http://www.vishay.com/docs/20035/dcrcwe3.pdf; Supplier 1: Digi-Key; Supplier Part Number 1: 541-10.0KHCT-ND; Supplier 2: Newark; Supplier Part Number 2: 52K8062; Supplier 3: Mouser; Supplier Part Number 3: 71-CRCW0603-10K-E3; AEC Qualified: ?; Green_EU RoHS: Passed with Exemption; Green_EU RoHS-2: Passed
R10 R16 R17 R29 R30 R33 R35 R36 = Resistor: RES, xxx ohm, x%, xW, [PackageReference]; U/M: EA; CompType: Resistor; SymbolVersion: 2009-05-29; PackageReference: Used in PnP output and some BOM reports; Manufacturer: Used in BOM report; PartNumber: Used in BOM report; RoHS: Used in BOM report.  Use Y or N.; MountType: SMT or TH (used in PnP report); ComponentLink1Description: Datasheet Link; ComponentLink1URL: Paste URL for datasheet here; Publisher: Texas Instruments; LatestRevisionDate: 2017-05-31; LatestRevisionNote: Added Alternate PartNumber and Alternate Manufacturer parameters to appropriate components.; Alternate Manufacturer: -; Alternate PartNumber: -
R15 = CRCW06032K00FKEA: RES, 2.00 k, 1%, 0.1 W, 0603; Manufacturer: Vishay-Dale; CompType: Resistor; Value: 2.00k; Res_ohm: 2000; Value_Code: 2k00; Tolerance_%: 1; Power_W: 0.1; Value2: 0.1W; VDC_V: 75; TempCo: 100 ppm/C; SizeArea_mm2: 1.28; SizeX_mm: 1.6; SizeY_mm: 0.8; EIA_Code: E96; U/M: EA; AEC Category: Q200; Green_Lifecycle: Active; Green_REACh: Passed; SymbolVersion: 2009-05-29; PartNumber: CRCW06032K00FKEA; PackageReference: 0603; RoHS: Y; Value1: 1%; MountType: SMT; Technology: Thick Film; SizeZ_mm: 1; Published: 2008-06-26; Publisher: Texas Instruments; LatestRevisionDate: 2017-06-13; ComponentLink1Description: Datasheet link; ComponentLink1URL: http://www.vishay.com/docs/20035/dcrcwe3.pdf; Supplier 1: Digi-Key; Supplier Part Number 1: 541-2.00KHCT-ND; Supplier 2: Newark; Supplier Part Number 2: 52K8223; Supplier 3: Mouser; Supplier Part Number 3: 71-CRCW0603-2.0K-E3; AEC Qualified: ?; Green_EU RoHS: Passed with Exemption; Green_EU RoHS-2: Passed
R18 = CRCW0603464KFKEA: RES, 464 k, 1%, 0.1 W, 0603; Manufacturer: Vishay-Dale; CompType: Resistor; Value: 464k; Res_ohm: 464000; Tolerance_%: 1; Power_W: 0.1; Value2: 0.1W; VDC_V: 75; TempCo: 100 ppm/C; SizeArea_mm2: 1.28; SizeX_mm: 1.6; SizeY_mm: 0.8; EIA_Code: E96; U/M: EA; AEC Category: Q200; SymbolVersion: 2009-05-29; PartNumber: CRCW0603464KFKEA; PackageReference: 0603; RoHS: Y; Value_Code: 464k; Value1: 1%; MountType: SMT; Technology: Thick Film; SizeZ_mm: 1; Published: 2008-06-26; Publisher: Texas Instruments; LatestRevisionDate: 2017-06-13; ComponentLink1Description: Datasheet link; ComponentLink1URL: http://www.vishay.com/docs/20035/dcrcwe3.pdf; Supplier 1: Digi-Key; Supplier Part Number 1: 541-464KHCT-ND; Supplier 2: Newark; Supplier Part Number 2: 52K8544; Supplier 3: Mouser; Supplier Part Number 3: 71-CRCW0603-464K-E3; AEC Qualified: ?
R21 R22 = RC0603JR-070RL: RES, 0, 5%, 0.1 W, 0603; Manufacturer: Yageo America; CompType: Resistor; Value: 0; Value_Code: 0000; Tolerance_%: 5; Power_W: 0.1; Value2: 0.1W; VDC_V: 50; TempCo: 200 ppm/C; SizeArea_mm2: 1.28; SizeX_mm: 1.6; SizeY_mm: 0.8; SizeZ_mm: 1; EIA_Code: E24; U/M: EA; AEC Category: Q200; Green_Lifecycle: Active; Green_REACh: Passed; SymbolVersion: 2009-05-29; PartNumber: RC0603JR-070RL; PackageReference: 0603; RoHS: Y; Res_ohm: 0; Value1: 5%; MountType: SMT; Technology: Thick Film; Published: 2008-06-26; Publisher: Texas Instruments; LatestRevisionDate: 2017-06-13; ComponentLink1Description: Datasheet link; ComponentLink1URL: http://www.yageo.com/pdf/Pu-RC0603_51_PbFree_L_2.pdf; Supplier 1: Digi-Key; Supplier Part Number 1: 311-0.0GRCT-ND; Supplier 2: Mouser; Supplier Part Number 2: 603-RC0603JR-070RL; Supplier 3: Farnell; Supplier Part Number 3: 9233130; AEC Qualified: ?; Green_EU RoHS: Passed with Exemption; Green_EU RoHS-2: Passed
R26 = CRCW0805390RJNEA: RES, 390, 5%, 0.125 W, 0805; Manufacturer: Vishay-Dale; CompType: Resistor; Value: 390; Value_Code: 390R; Tolerance_%: 5; Power_W: 0.125; Value2: 0.125W; VDC_V: 150; TempCo: 200 ppm/C; SizeArea_mm2: 2.5; SizeX_mm: 2; SizeY_mm: 1.25; SizeZ_mm: 1.45; EIA_Code: E24; U/M: EA; AEC Category: Q200; SymbolVersion: 2009-05-29; PartNumber: CRCW0805390RJNEA; PackageReference: 0805; RoHS: Y; Res_ohm: 390; Value1: 5%; MountType: SMT; Technology: Thick Film; Published: 2008-06-26; Publisher: Texas Instruments; LatestRevisionDate: 2017-06-23; ComponentLink1Description: Datasheet link; ComponentLink1URL: http://www.vishay.com/docs/20035/dcrcwe3.pdf; Supplier 1: Digi-Key; Supplier Part Number 1: 541-390ACT-ND; Supplier 2: Newark; Supplier Part Number 2: 59M6897; Supplier 3: Mouser; Supplier Part Number 3: 71-CRCW0805390RJNEA; AEC Qualified: ?
R34 = CRCW0603562KFKEA: RES, 562 k, 1%, 0.1 W, 0603; Manufacturer: Vishay-Dale; CompType: Resistor; Value: 562k; Res_ohm: 562000; Tolerance_%: 1; Power_W: 0.1; Value2: 0.1W; VDC_V: 75; TempCo: 100 ppm/C; SizeArea_mm2: 1.28; SizeX_mm: 1.6; SizeY_mm: 0.8; EIA_Code: E96; U/M: EA; AEC Category: Q200; SymbolVersion: 2009-05-29; PartNumber: CRCW0603562KFKEA; PackageReference: 0603; RoHS: Y; Value_Code: 562k; Value1: 1%; MountType: SMT; Technology: Thick Film; SizeZ_mm: 1; Published: 2008-06-26; Publisher: Texas Instruments; LatestRevisionDate: 2017-06-13; ComponentLink1Description: Datasheet link; ComponentLink1URL: http://www.vishay.com/docs/20035/dcrcwe3.pdf; Supplier 1: Digi-Key; Supplier Part Number 1: 541-562KHCT-ND; Supplier 2: Newark; Supplier Part Number 2: 42K3965; Supplier 3: Mouser; Supplier Part Number 3: 71-CRCW0603-562K-E3; AEC Qualified: ?
TP1 TP2 TP5 TP6 TP8 = 5000: Test Point, Miniature, Red, TH; Manufacturer: Keystone; CompType: Test Point Loop; ContactFinish: Silver; Green_Lifecycle: Active; Green_REACh: Passed; SymbolVersion: 2008-04-04; PartNumber: 5000; PackageReference: Red Miniature Testpoint; RoHS: Y; MountType: TH; ComponentLink1Description: Datasheet URL; ComponentLink1URL: http://www.keyelco.com/userAssets/file/M60-2p60.pdf; Color: Red; Publisher: Texas Instruments; LatestRevisionDate: 2017-05-11; Supplier 1: Digi-Key; Supplier Part Number 1: 36-5000-ND; Supplier 2: Mouser; Supplier Part Number 2: 534-5000; Green_EU RoHS: Passed; Green_EU RoHS-2: Incomplete
TP3 TP4 TP7 = 5001: Test Point, Miniature, Black, TH; Manufacturer: Keystone; CompType: Test Point Loop; ContactFinish: Silver; Green_Lifecycle: Active; Green_REACh: Passed; SymbolVersion: 2008-04-04; PartNumber: 5001; PackageReference: Black Miniature Testpoint; RoHS: Y; MountType: TH; ComponentLink1Description: Datasheet URL; ComponentLink1URL: http://www.keyelco.com/userAssets/file/M60-2p60.pdf; Color: Black; Publisher: Texas Instruments; LatestRevisionDate: 2017-05-11; Supplier 1: Digi-Key; Supplier Part Number 1: 36-5001-ND; Supplier 2: Mouser; Supplier Part Number 2: 534-5001; Green_EU RoHS: Passed; Green_EU RoHS-2: Incomplete
U1 = CMP-0037800-2: Buck Step Down Regulator with 3 to 17 V Input and 5 V Output, -40 to 85 degC, 8-Pin WSON (DSG), Green (RoHS & no Sb/Br); Manufacturer: Texas Instruments; Vin(Min)(V): 3; Switch Current Limit(Typ)(A): 1.05; Vin(Max)(V): 17; Rating: Catalog; Vout(Min)(V): 5; Regulated Outputs(#): 1; Duty Cycle(Max)(%): 100; SubFamily: Step-Down Regulator; Synchronous Rectification: TRUE; Iq(Typ)(mA): 0.017; Iout(Max)(A): 0.5; ComponentLink1URL: http://www.ti.com/general/docs/lit/getliterature.tsp?genericPartNumber=TPS62173&fileType=pdf; Code_JEDEC: MO-229; PackageDescription: 8-Pin Plastic Small Outline No-Lead, 2 x 2 x 0.8 mm Body, 0.5 mm Pitch, Exposed Pad; ComponentLink2URL: http://www.ti.com/litv/pdf/mpds308a; ComponentLink3Description: URL Link1; Eco-Plan: Green (RoHS & no Sb/Br); ComponentLink2Description: Package Specification; Topology: Buck; ComponentLink3URL: Samples URL:http://www.ti.com/product/tps54611#samples; PackageReference: DSG0008A; Preset Vout(V): 5; DatasheetVersion: SLVSAT8A; Vout(Max)(V): 5; PartNumber: TPS62173DSGT; PackageVersion: revB, Oct-2010; ComponentLink1Description: Datasheet; Mounting Technology: Surface Mount
U2 = CMP-0079625-1: 1.25-MHz / 2.5-MHz High Accuracy 3-V to 17-V 2-A Step-Down Converter With DCS-Control, RGX0011A (VQFN-HR-11); Alternate PartNumber: TPS62147RGXR; Alternate Manufacturer: Texas Instruments; SizeAreaWB_mm2: 12; SizeZ_mm: 1; SizeX_mm: 2; SizeY_mm: 3; SizeArea_mm2: 6; CompType: IC; AEC Qualified: N; AEC Category: Q200; ComponentLink1URL: http://www.ti.com/lit/ds/symlink/tps62147.pdf; PackageDescription: VQFN-HR-11; MountType: SMT; ComponentLink2URL: http://www.ti.com/product/tps62147; ComponentLink3Description: Online Datasheet; ComponentLink2Description: Product Folder; Manufacturer: Texas Instruments; ComponentLink3URL: http://www.ti.com/product/tps62147/datasheet; PackageReference: RGX0011A; PartNumber: TPS62147RGXT; ComponentLink1Description: Datasheet Link
U3 = TL431CDBZTG4: Adjustable Precision Shunt Regulator, 34 ppm / degC, 100 mA, 0 to 70 degC, 3-pin SOT-23 (DBZ), Green (RoHS & no Sb/Br); Manufacturer: Texas Instruments; Alternate PartNumber: Equivalent; Initial Accuracy @ 25/deg C(%): 2; Iout/Iz(Max)(mA): 100; Min Iz for Regulation(uA): 600; Rating: Military; SubFamily: Shunt Voltage Reference; Temp Coeff(Max)(ppm/ degree C): 92; Temp Coeff(Typ)(ppm/ degree C): 34; VO Adj(Max)(V): 36; VO Adj(Min)(V): 2.495; DatasheetVersion: SLVS543M; PackageVersion: 4203227/B; PackageReference: DBZ0003A; PackageDescription: 3-Pin Plastic Small Outline, Body 2.92 x 1.3 mm, Pitch 0.95 mm; Supplier 1: Digi-Key; Supplier Part Number 1: TL431CDBZTG4-ND; Supplier 2: Newark; Supplier Part Number 2: 31K7746; Supplier 3: Mouser; Supplier Part Number 3: 595-TL431CDBZTG4; Eco-Plan: Green (RoHS & no Sb/Br); MountType: SMT; Code_JEDEC: TO-236; ComponentLink1Description: Manufacturer URL; ComponentLink1URL: http://www.ti.com/; ComponentLink2Description: Datasheet; ComponentLink2URL: http://www.ti.com/general/docs/lit/getliterature.tsp?genericPartNumber=TL431&fileType=pdf; ComponentLink3Description: Package Specification; ComponentLink3URL: http://www.ti.com/litv/pdf/mpds108a; Alternate Manufacturer: Texas Instruments; PartNumber: TL431CDBZTG4
U4 = TPS610981DSER: Low Input Voltage Synchronous Boost Converter with Integrated LDO/Load Switch, DSE0006A (WSON-6); Alternate PartNumber: TPS610981DSET; Manufacturer: Texas Instruments; SymbolCreator: Altium; SizeArea_mm2: 2.25; SizeAreaWB_mm2: 6.25; SizeX_mm: 1.5; SizeZ_mm: 0.8; CompType: IC; U/M: EA; Green_Lifecycle: Active; Green_REACh: Passed; SymbolVersion: 2015-06-03; PartNumber: TPS610981DSER; PackageReference: DSE0006A; PackageDescription: WSON-6; MountType: SMT; SizeY_mm: 1.5; ComponentLink1Description: Datasheet Link; ComponentLink1URL: http://www.ti.com/lit/ds/symlink/tps610981.pdf; RoHS: Y; Publisher: Texas Instruments; LatestRevisionDate: 2017-05-22; Alternate Manufacturer: Texas Instruments; Green_EU RoHS: Passed; Green_EU RoHS-2: Passed
U5 = CMP-0078851-2: 8-A Boost Converter with 0.5-V Ultra-Low Input Voltage, RWU0007A (VQFN-HR-7); Alternate PartNumber: TPS61022RWUR; Alternate Manufacturer: Texas Instruments; SizeAreaWB_mm2: 9; SizeZ_mm: 1; SizeX_mm: 2; SizeArea_mm2: 4; CompType: IC; AEC Qualified: N; AEC Category: Q200; ComponentLink1URL: http://www.ti.com/lit/ds/symlink/tps61022.pdf; PackageDescription: VQFN-HR-7; MountType: SMT; ComponentLink2URL: http://www.ti.com/product/tps61022; ComponentLink2Description: Product Folder; Manufacturer: Texas Instruments; PackageReference: RWU0007A; SizeY_mm: 2; PartNumber: TPS61022RWUT; ComponentLink1Description: Datasheet Link; ComponentLink3Description: Online Datasheet; ComponentLink3URL: http://www.ti.com/product/GPN/datasheet